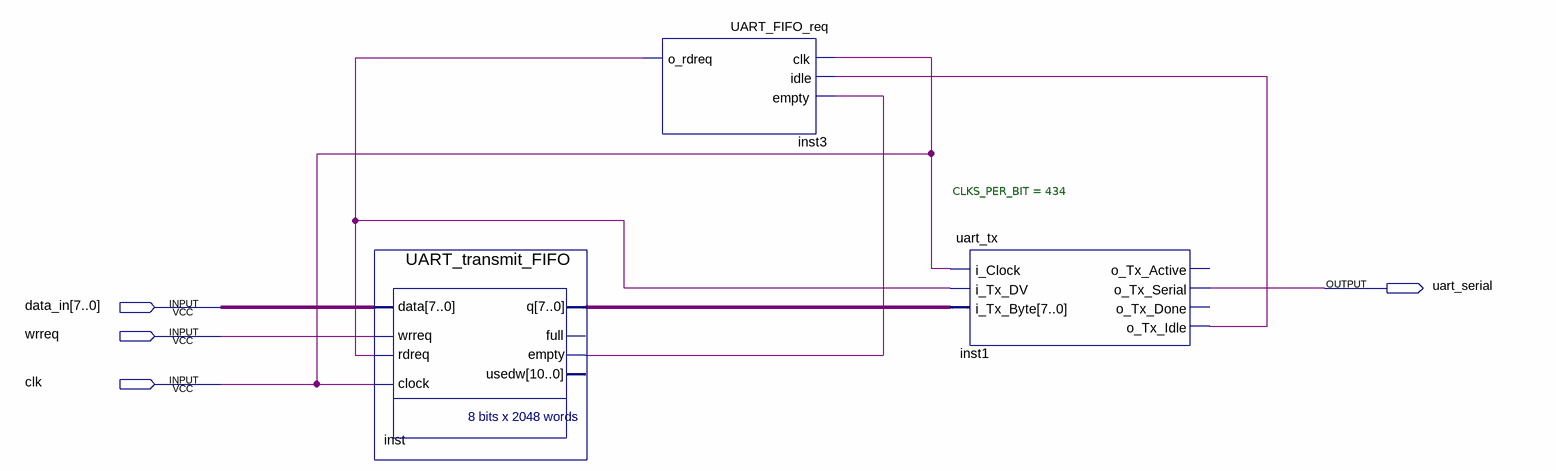
[diagram p0: schematic sheet]
// Quartus schematic uart_dumper.bdf as structural Verilog: 3 symbols, 4 pins
module uart_dumper (
  input  [7:0] data_in,
  input  wrreq,
  input  clk,
  output uart_serial
);

  wire inst1_o_tx_idle, inst3_o_rdreq, inst_empty;
  wire [7:0] inst_q;

  UART_transmit_FIFO inst (
    .data(data_in), .wrreq(wrreq), .rdreq(inst3_o_rdreq), .clock(clk), .q(inst_q), .empty(inst_empty));  // open: full, usedw
  UART_FIFO_req inst3 (.clk(clk), .idle(inst1_o_tx_idle), .empty(inst_empty), .o_rdreq(inst3_o_rdreq));
  uart_tx #(.CLKS_PER_BIT(434)) inst1 (
    .i_Clock(clk), .i_Tx_DV(inst3_o_rdreq), .i_Tx_Byte(inst_q), .o_Tx_Serial(uart_serial),
    .o_Tx_Idle(inst1_o_tx_idle));  // open: o_Tx_Active, o_Tx_Done
endmodule
